# Altium schematic sheet InputChannel_2.SchDoc
size A3; SheetNumber: 1; SheetTotal: 1; PageSetup: Record=PageOptions|CenterHorizontal=True|CenterVertical=True|PrintScale=0.97|XCorrection=1.00|YCorrection=1.00|PrintKind=1|BorderSize=5000000|LeftOffset=0|BottomOffset=0|Orientation=2|PaperLength=2970|PaperWidth=2100|Scale=100|PaperSource=7|PrintQuality=600|MediaType=1|DitherType=10|PaperKind=A4|PrintScaleMode=1
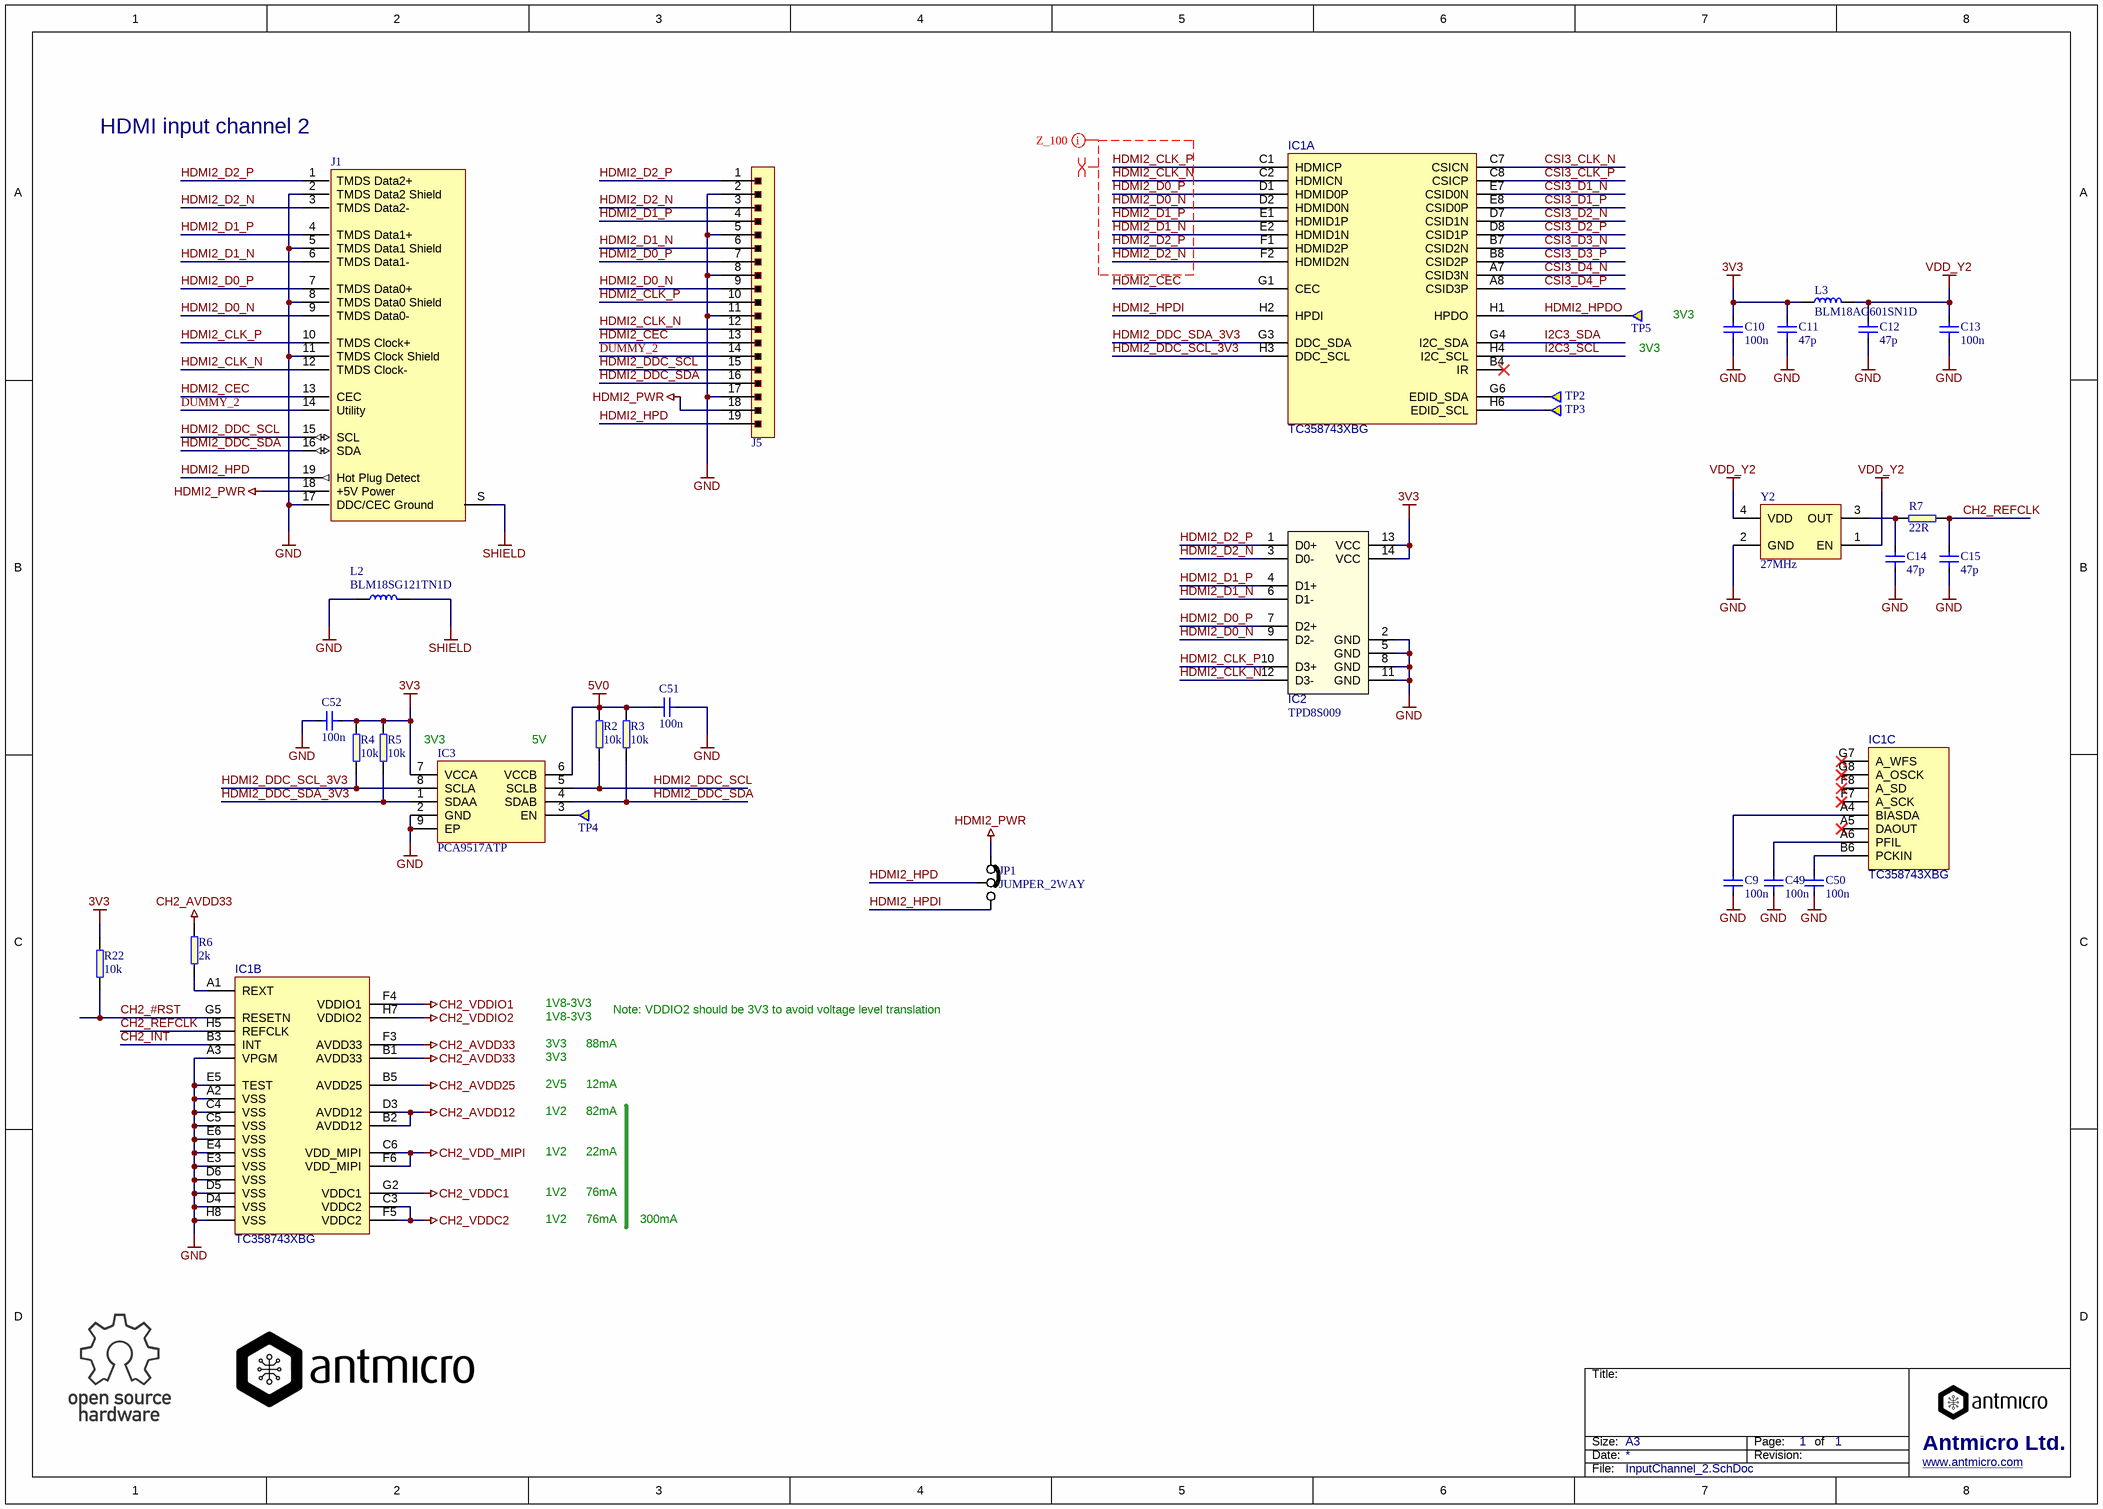
[diagram p0: InputChannel_2.SchDoc]

## Parts
C9  100n  [0402]
C10  100n  [0402]
C11  47p  [0402]
C12  47p  [0402]
C13  100n  [0402]
C14  47p  [0402]
C15  47p  [0402]
C49  100n  [0402]
C50  100n  [0402]
C51  100n  [0402]
C52  100n  [0402]
IC1  TC358743XBG  [TC358743XBG]  (parts A,B,C of 3)
IC2  TPD8S009  [SON-15]
IC3  PCA9517ATP  [PCA9517ATP]
J1  (no value)  [Molex_HDMI_471511001]
J5  Molex-505110-1992  [CON-Molex-505110-1992]  (value not drawn)
JP1  JUMPER_2WAY  [JUMPER_2WAY]  (no BOM)
L2  BLM18SG121TN1D  [0603]
L3  BLM18AG601SN1D  [0603]
R2  10k  [0402]
R3  10k  [0402]
R4  10k  [0402]
R5  10k  [0402]
R6  2k  [0603]
R7  22R  [0402]
R22  10k  [0402]
TP2  Testpad  [TP-R-1]  (value not drawn)  (no BOM)
TP3  Testpad  [TP-R-1]  (value not drawn)  (no BOM)
TP4  Testpad  [TP-R-1]  (value not drawn)  (no BOM)
TP5  Testpad  [TP-R-1]  (value not drawn)  (no BOM)
Y2  27MHz  [TXC_7C]

## Nets
3V3: C10.2 C11.2 C52.1 IC2.13(VCC) IC2.14(VCC) IC3.7(VCCA) L3.1 R4.2 R5.2 R22.2
5V0: C51.2 IC3.6(VCCB) R2.2 R3.2
CH2_AVDD12: IC1.B2(AVDD12) IC1.D3(AVDD12)
CH2_AVDD25: IC1.B5(AVDD25)
CH2_AVDD33: IC1.B1(AVDD33) IC1.F3(AVDD33) R6.2
CH2_VDD_MIPI: IC1.C6(VDD_MIPI) IC1.F6(VDD_MIPI)
CH2_VDDC1: IC1.G2(VDDC1)
CH2_VDDC2: IC1.C3(VDDC2) IC1.F5(VDDC2)
CH2_VDDIO1: IC1.F4(VDDIO1)
CH2_VDDIO2: IC1.H7(VDDIO2)
GND: C9.1 C10.1 C11.1 C12.1 C13.1 C14.1 C15.1 C49.1 C50.1 C51.1 C52.2 IC1.A2(VSS) IC1.A3(VPGM) IC1.C4(VSS) IC1.C5(VSS) IC1.D4(VSS) IC1.D5(VSS) IC1.D6(VSS) IC1.E3(VSS) IC1.E4(VSS) IC1.E5(TEST) IC1.E6(VSS) IC1.H8(VSS) IC2.2(GND) IC2.5(GND) IC2.8(GND) IC2.11(GND) IC3.2(GND) IC3.9(EP) J1.2(TMDS_Data2_Shield) J1.5(TMDS_Data1_Shield) J1.8(TMDS_Data0_Shield) J1.11(TMDS_Clock_Shield) J1.17(DDC/CEC_Ground) J5.2 J5.5 J5.8 J5.11 J5.17 L2.1 Y2.2(GND)
HDMI2_PWR: J1.18(+5V_Power) J5.18 JP1.1
SHIELD: J1.S(SH) L2.2
VDD_Y2: C12.2 C13.2 L3.2 Y2.1(EN) Y2.4(VDD)
CH2_#RST: IC1.G5(RESETN) R22.1
CH2_INT: IC1.B3(INT)
CH2_REFCLK: C15.2 IC1.H5(REFCLK) R7.2
CSI3_CLK_N: IC1.C7(CSICN)
CSI3_CLK_P: IC1.C8(CSICP)
CSI3_D1_N: IC1.E7(CSID0N)
CSI3_D1_P: IC1.E8(CSID0P)
CSI3_D2_N: IC1.D7(CSID1N)
CSI3_D2_P: IC1.D8(CSID1P)
CSI3_D3_N: IC1.B7(CSID2N)
CSI3_D3_P: IC1.B8(CSID2P)
CSI3_D4_N: IC1.A7(CSID3N)
CSI3_D4_P: IC1.A8(CSID3P)
DUMMY_2: J1.14(Utility) J5.14
HDMI2_CEC: IC1.G1(CEC) J1.13(CEC) J5.13
HDMI2_CLK_N: IC1.C2(HDMICN) IC2.12(D3-) J1.12(TMDS_Clock-) J5.12
HDMI2_CLK_P: IC1.C1(HDMICP) IC2.10(D3+) J1.10(TMDS_Clock+) J5.10
HDMI2_D0_N: IC1.D2(HDMID0N) IC2.9(D2-) J1.9(TMDS_Data0-) J5.9
HDMI2_D0_P: IC1.D1(HDMID0P) IC2.7(D2+) J1.7(TMDS_Data0+) J5.7
HDMI2_D1_N: IC1.E2(HDMID1N) IC2.6(D1-) J1.6(TMDS_Data1-) J5.6
HDMI2_D1_P: IC1.E1(HDMID1P) IC2.4(D1+) J1.4(TMDS_Data1+) J5.4
HDMI2_D2_N: IC1.F2(HDMID2N) IC2.3(D0-) J1.3(TMDS_Data2-) J5.3
HDMI2_D2_P: IC1.F1(HDMID2P) IC2.1(D0+) J1.1(TMDS_Data2+) J5.1
HDMI2_DDC_SCL: IC3.5(SCLB) J1.15(SCL) J5.15 R2.1
HDMI2_DDC_SCL_3V3: IC1.H3(DDC_SCL) IC3.8(SCLA) R4.1
HDMI2_DDC_SDA: IC3.4(SDAB) J1.16(SDA) J5.16 R3.1
HDMI2_DDC_SDA_3V3: IC1.G3(DDC_SDA) IC3.1(SDAA) R5.1
HDMI2_HPD: J1.19(Hot_Plug_Detect) J5.19 JP1.2
HDMI2_HPDI: IC1.H2(HPDI) JP1.3
HDMI2_HPDO: IC1.H1(HPDO) TP5.1
I2C3_SCL: IC1.H4(I2C_SCL)
I2C3_SDA: IC1.G4(I2C_SDA)
NetC9_2: C9.2 IC1.A4(BIASDA)
NetC14_2: C14.2 R7.1 Y2.3(OUT)
NetC49_2: C49.2 IC1.A6(PFIL)
NetC50_2: C50.2 IC1.B6(PCKIN)
NetIC1_A1: IC1.A1(REXT) R6.1
NetIC1_G6: IC1.G6(EDID_SDA) TP2.1
NetIC1_H6: IC1.H6(EDID_SCL) TP3.1
NetIC3_3: IC3.3(EN) TP4.1

Not connected (* = marked no-connect by the designer): IC1 A5(DAOUT)* B4(IR)* F7(A_SCK)* F8(A_SD)* G7(A_WFS)* G8(A_OSCK)*

## Layout directives
net class Z_100: HDMI2_CLK_N, HDMI2_CLK_P, HDMI2_D0_N, HDMI2_D0_P, HDMI2_D1_N, HDMI2_D1_P, HDMI2_D2_N, HDMI2_D2_P
differential pair: HDMI2_CLK_N, HDMI2_CLK_P, HDMI2_D0_N, HDMI2_D0_P, HDMI2_D1_N, HDMI2_D1_P, HDMI2_D2_N, HDMI2_D2_P

## Notes on the sheet
- (near J1) HDMI input channel 2
- 3V3
- (near TP5) 3V3
- (near IC3) 5V
- 1V8-3V3
- 88mA
- Note: VDDIO2 should be 3V3 to avoid voltage level translation
- 2V5
- 1V2
- 82mA
- 12mA
- 22mA
- 76mA
- 300mA
- Title:
- Size:
- Date:
- A3
- Revision:
- Page:
- of
- Antmicro Ltd.
- File:
- www.antmicro.com

## Library data of the parts
C9 C10 C13 C49-C52 = C_100n_0402: MLCC SMT Capacitor 100nF 0402; Manufacturer: MULTICOMP; MPN: MC0402X104M100CT; Part Number: C_100n_0402; Value: 100n; Supplier 1: Farnell; Supplier Part Number 1: 2309011
C11 C12 C14 C15 = C_47p_0402: MLCC SMT Capacitor 47pF 0402; Manufacturer: KEMET; MPN: C0402C470J5GACTU; Part Number: C_47p_0402; Value: 47p; Supplier 1: Farnell; Supplier Part Number 1: 1414592
IC1 = TC358743XBG: Toshiba TC358743XBG HDMI-CSI bridge; Part Number: TC358743XBG; Value: TC358743XBG; Manufacturer: Toshiba; MPN: TC358743XBG
IC2 = TPD8S009: 8-Channel ESD Protection for DisplayPort and HDMI; Manufacturer: TEXAS INSTRUMENTS; MPN: TPD8S009DSMR; Part Number: TPD8S009; Value: TPD8S009; Supplier 1: Farnell; Supplier Part Number 1: 1772003
IC3 = PCA9517ATP: I2C BUS REPEATER W/ LEVEL TRANS, HWSON-8; Manufacturer: NXP; Part Number: PCA9517ATP; Value: PCA9517ATP; Supplier 1: Digi-Key; Supplier Part Number 1: 568-9816-1-ND; MPN: PCA9517ATP
J1 = CON-Molex-471511001: Header right angle HDMI; Manufacturer: MOLEX; MPN: 47151-1001; Part Number: CON-Molex-471511001; Supplier 1: Farnell; Supplier Part Number 1: 1516661
J5 = CON-Molex-505110-1992: FPC socket 19 pins; Manufacturer: Molex; Part Number: CON-Molex-505110-1992; Supplier Part Number 1: WM12375CT-ND; Value: Molex-505110-1992; Supplier 1: Digi-Key; MPN: 505110-1992
JP1 = Jumper 2 way: Solder jumper; Part Number: Jumper 2 way
L2 = BLM18SG121TN1D: FERRITE BEAD, 0.025OHM, 3A, 0603; Manufacturer: MURATA; Part Number: BLM18SG121TN1D; Value: BLM18SG121TN1D; Supplier 1: Farnell; Supplier Part Number 1: 1515752; MPN: BLM18SG121TN1D
L3 = BLM18AG601SN1D: Ferrite Bead, 600 ohm, 0603 [1608 Metric], BLM18A Series, 500 mA, 0.38 ohm, ± 25%; Manufacturer: MURATA; Part Number: BLM18AG601SN1D; Value: BLM18AG601SN1D; Supplier 1: Farnell; Supplier Part Number 1: 1515679; MPN: BLM18AG601SN1D
R2-R5 R22 = R_10k_0402: SMT Resistor 0402; Manufacturer: MULTICOMP; MPN: MCMR04X1002FTL; Part Number: R_10k_0402; Value: 10k; Supplier 1: Farnell; Supplier Part Number 1: 2072517
R6 = R_2k_0603: SMT Resistor 2k 0603; Manufacturer: MULTICOMP; MPN: MCMR06X2001FTL; Part Number: R_2k_0603; Value: 2k; Supplier 1: Farnell; Supplier Part Number 1: 2073418
R7 = R_22R_0402: SMT Resistor 22R 0402; Manufacturer: VISHAY; MPN: CRCW040222R0FKED; Part Number: R_22R_0402; Value: 22R; Supplier 1: Farnell; Supplier Part Number 1: 1469697
TP2-TP5 = TP-R-1: Testpad, round, 1mm; Part Number: TP-R-1
Y2 = 7C-27.000MBB-T: OSC, 27.000MHZ, 3.3V, SMD, 5.0X3.2; Manufacturer: TXC; Part Number: 7C-27.000MBB-T; Value: 27MHz; Supplier 1: Farnell; Supplier Part Number 1: 1842035; MPN: 7C-27.000MBB-T